# Altium project SG_CAN_Board_2019.PrjPCB
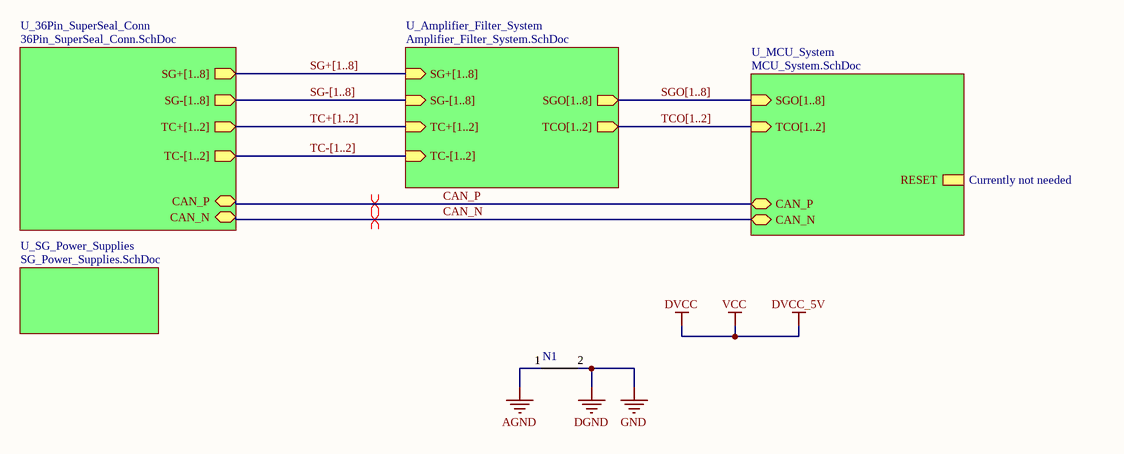
[diagram p0: SG_CAN_System.SchDoc]
7 sheets, 109 parts. Net scope: hierarchical (ports join the sheet entries above them; power ports are global).
Board file: SG_CAN_Board.PcbDoc
Sheets:
  SG_CAN_System.SchDoc
    U_MCU_System = MCU_System.SchDoc
    U_Amplifier_Filter_System = Amplifier_Filter_System.SchDoc
      SG1 = SG_Amplifiers_LTC2053.SchDoc
      SG2 = SG_Amplifiers_LTC2053.SchDoc
      SG3 = SG_Amplifiers_LTC2053.SchDoc
      SG4 = SG_Amplifiers_LTC2053.SchDoc
      SG5 = SG_Amplifiers_LTC2053.SchDoc
      SG6 = SG_Amplifiers_LTC2053.SchDoc
      SG7 = SG_Amplifiers_LTC2053.SchDoc
      SG8 = SG_Amplifiers_LTC2053.SchDoc
      Th1 = ThermocoupleAmplifiersAD8494.SchDoc
      Th2 = ThermocoupleAmplifiersAD8494.SchDoc
    U_36Pin_SuperSeal_Conn = 36Pin_SuperSeal_Conn.SchDoc
    U_SG_Power_Supplies = SG_Power_Supplies.SchDoc

## Sheet SG_CAN_System.SchDoc
size A

### Parts
N1  (no value)  [Net_Tie]

### Sub-sheets
U_36Pin_SuperSeal_Conn = 36Pin_SuperSeal_Conn.SchDoc: SG+[1..8] (out), SG-[1..8] (out), CAN_P (bidir), CAN_N (bidir), TC+[1..2] (out), TC-[1..2] (out)
U_Amplifier_Filter_System = Amplifier_Filter_System.SchDoc: SG+[1..8] (in), SG-[1..8] (in), SGO[1..8] (out), TC+[1..2] (in), TC-[1..2] (in), TCO[1..2] (out)
U_MCU_System = MCU_System.SchDoc: SGO[1..8] (in), TCO[1..2] (in), CAN_P (bidir), CAN_N (bidir), RESET
U_SG_Power_Supplies = SG_Power_Supplies.SchDoc: no entries

### Nets
AGND: N1.1
DGND: N1.2  [also labelled GND]
CAN_N: sheet U_MCU_System/CAN_N, sheet U_36Pin_SuperSeal_Conn/CAN_N
CAN_P: sheet U_MCU_System/CAN_P, sheet U_36Pin_SuperSeal_Conn/CAN_P

### Buses and harness runs
bus SG+[1..8] = sheet U_36Pin_SuperSeal_Conn/SG+[1..8] = sheet U_Amplifier_Filter_System/SG+[1..8]
bus SG-[1..8] = sheet U_36Pin_SuperSeal_Conn/SG-[1..8] = sheet U_Amplifier_Filter_System/SG-[1..8]
bus SGO[1..8] = sheet U_Amplifier_Filter_System/SGO[1..8] = sheet U_MCU_System/SGO[1..8]
bus TC+[1..2] = sheet U_36Pin_SuperSeal_Conn/TC+[1..2] = sheet U_Amplifier_Filter_System/TC+[1..2]
bus TC-[1..2] = sheet U_36Pin_SuperSeal_Conn/TC-[1..2] = sheet U_Amplifier_Filter_System/TC-[1..2]
bus TCO[1..2] = sheet U_Amplifier_Filter_System/TCO[1..2] = sheet U_MCU_System/TCO[1..2]

### Layout directives
differential pair: CAN_N, CAN_P

### Notes on the sheet
- Currently not needed

### Library data of the parts
N1 = 1: Manufacturer_id: 1; idFuse: 3; Name: Net Tie; Drawer_id: 1; idShunt: 1

## Sheet MCU_System.SchDoc
size A
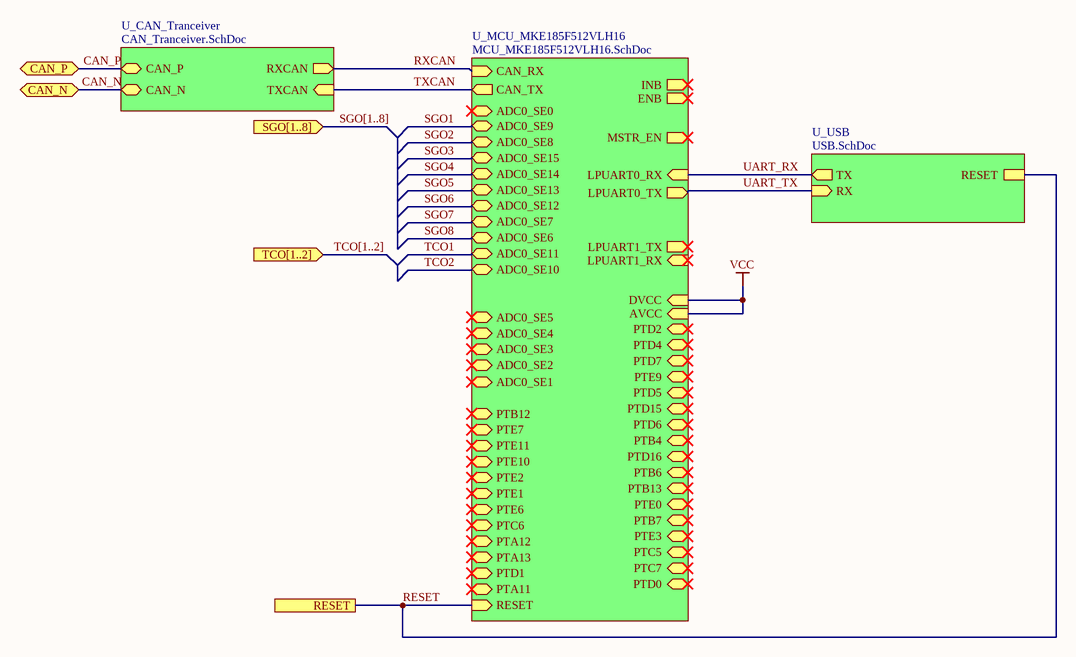
[diagram p1: MCU_System.SchDoc]

### Sub-sheets
U_CAN_Tranceiver = CAN_Tranceiver.SchDoc (file not in this document): TXCAN (in), RXCAN (out), CAN_P (bidir), CAN_N (bidir)
U_MCU_MKE185F512VLH16 = MCU_MKE185F512VLH16.SchDoc (file not in this document): CAN_TX (out), CAN_RX (in), INB (out), ENB (out), ADC0_SE11 (bidir), ADC0_SE10 (bidir), ADC0_SE9 (bidir), ADC0_SE8 (bidir), ADC0_SE15 (bidir), ADC0_SE14 (bidir), ADC0_SE13 (bidir), ADC0_SE12 (bidir), ADC0_SE7 (bidir), ADC0_SE6 (bidir), ADC0_SE1 (bidir), ADC0_SE0 (bidir), LPUART0_TX (out), LPUART0_RX (in), MSTR_EN (out), ADC0_SE5 (bidir), ADC0_SE4 (bidir), LPUART1_TX (out), LPUART1_RX (in), ADC0_SE3 (bidir), ADC0_SE2 (bidir), DVCC (in), AVCC (in), RESET (in), PTD2 (bidir), PTD4 (bidir), PTD7 (bidir), PTE9 (bidir), PTD5 (bidir), PTD15 (bidir), PTD6 (bidir), PTB4 (bidir), PTD16 (bidir), PTB6 (bidir), PTB13 (bidir), PTE0 (bidir), PTB7 (bidir), PTE3 (bidir), PTC5 (bidir), PTC7 (bidir), PTD0 (bidir), PTB12 (bidir), PTE7 (bidir), PTE11 (bidir), PTE10 (bidir), PTE2 (bidir), PTE1 (bidir), PTE6 (bidir), PTC6 (bidir), PTA12 (bidir), PTA13 (bidir), PTD1 (bidir), PTA11 (bidir)
U_USB = USB.SchDoc (file not in this document): TX (out), RX (in), RESET

### Ports
CAN_N (bidir), CAN_P (bidir), RESET, SGO[1..8] (in), TCO[1..2] (in)

### Nets
VCC: sheet U_MCU_MKE185F512VLH16/DVCC, sheet U_MCU_MKE185F512VLH16/AVCC  [project net DVCC]
CAN_N: port CAN_N, sheet U_CAN_Tranceiver/CAN_N
CAN_P: port CAN_P, sheet U_CAN_Tranceiver/CAN_P
RESET: port RESET, sheet U_USB/RESET, sheet U_MCU_MKE185F512VLH16/RESET
RXCAN: sheet U_CAN_Tranceiver/RXCAN, sheet U_MCU_MKE185F512VLH16/CAN_RX
TXCAN: sheet U_CAN_Tranceiver/TXCAN, sheet U_MCU_MKE185F512VLH16/CAN_TX
UART_RX: sheet U_USB/TX, sheet U_MCU_MKE185F512VLH16/LPUART0_RX
UART_TX: sheet U_USB/RX, sheet U_MCU_MKE185F512VLH16/LPUART0_TX

### Buses and harness runs
bus SGO[1..8] = port SGO[1..8]
bus TCO[1..2] = port TCO[1..2]

## Sheet Amplifier_Filter_System.SchDoc
size A
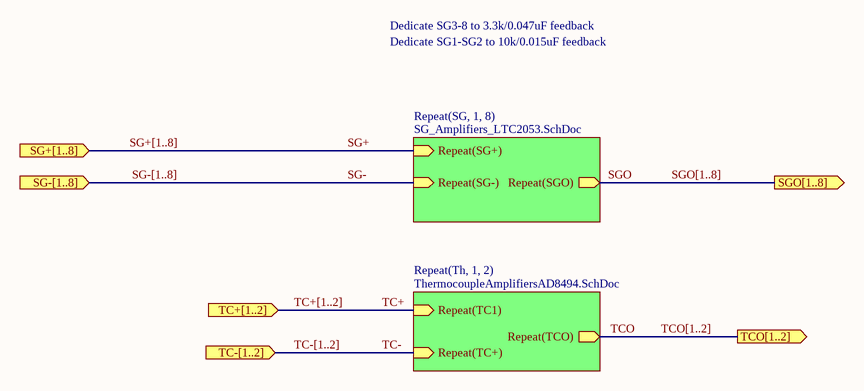
[diagram p2: Amplifier_Filter_System.SchDoc]

### Sub-sheets
Repeat(SG, 1, 8) = SG_Amplifiers_LTC2053.SchDoc: Repeat(SG+) (in), Repeat(SG-) (in), Repeat(SGO) (out)
Repeat(Th, 1, 2) = ThermocoupleAmplifiersAD8494.SchDoc: Repeat(TC1) (in), Repeat(TC+) (in), Repeat(TCO) (out)

### Ports
SG+[1..8] (in), SG-[1..8] (in), SGO[1..8] (out), TC+[1..2] (in), TC-[1..2] (in), TCO[1..2] (out)

### Nets
SG+: sheet Repeat(SG, 1, 8)/Repeat(SG+)
SG-: sheet Repeat(SG, 1, 8)/Repeat(SG-)
SGO: sheet Repeat(SG, 1, 8)/Repeat(SGO)
TC+: sheet Repeat(Th, 1, 2)/Repeat(TC1)
TC-: sheet Repeat(Th, 1, 2)/Repeat(TC+)
TCO: sheet Repeat(Th, 1, 2)/Repeat(TCO)

### Buses and harness runs
bus SG+[1..8] = port SG+[1..8]
bus SG-[1..8] = port SG-[1..8]
bus SGO[1..8] = port SGO[1..8]
bus TC+[1..2] = port TC+[1..2]
bus TC-[1..2] = port TC-[1..2]
bus TCO[1..2] = port TCO[1..2]

### Notes on the sheet
- Dedicate SG3-8 to 3.3k/0.047uF feedback
- Dedicate SG1-SG2 to 10k/0.015uF feedback

## Sheet SG_Amplifiers_LTC2053.SchDoc
size A
Used 8 times, as channels U_Amplifier_Filter_System/SG1, U_Amplifier_Filter_System/SG2, U_Amplifier_Filter_System/SG3, U_Amplifier_Filter_System/SG4, U_Amplifier_Filter_System/SG5, U_Amplifier_Filter_System/SG6, U_Amplifier_Filter_System/SG7, U_Amplifier_Filter_System/SG8. Parts and nets are listed once, with the designators drawn on the sheet.
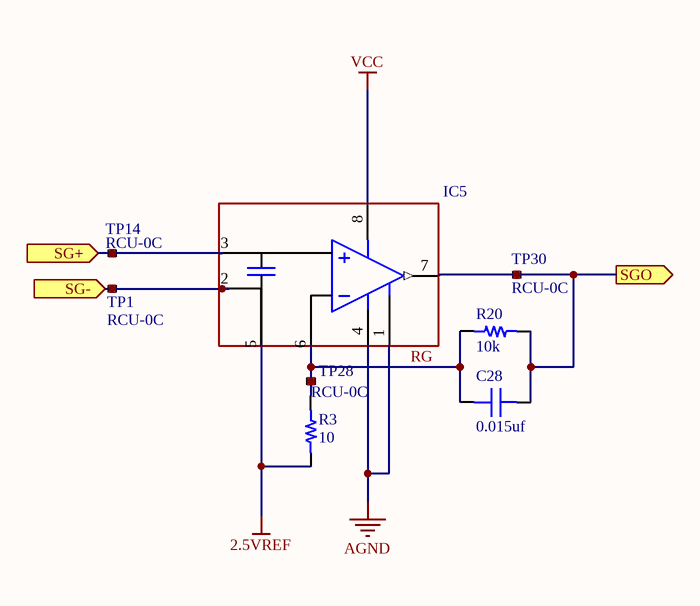
[diagram p3: SG_Amplifiers_LTC2053.SchDoc]

### Parts
C28  value 0.015uf  [CAP 0603/1608]  (hidden comment: Capacitor MLCC 0.015uf 25V CAP 0603/1608)
IC5  (no value)  [MSOP-8]
R3  value 10  [RES 0603/1608]  (hidden comment: Resistor 10 0603 1/10W 1%)
R20  value 10k  [RES 0603/1608]  (hidden comment: Resistor 10k 0603 1/10W 1%)
TP1  RCU-0C  [RCU-0C]
TP14  RCU-0C  [RCU-0C]
TP28  RCU-0C  [RCU-0C]
TP30  RCU-0C  [RCU-0C]

### Ports
SG+ (in), SG- (in), SGO (out)

### Nets
2.5VREF: IC5.5(REF) R3.1
AGND: IC5.1 IC5.4(V-)
VCC: IC5.8(V+)
RG: C28.1 IC5.6(RG) R3.2 R20.1 TP28.1
SG+: IC5.3(+IN) TP14.1 ; port SG+
SG-: IC5.2(-IN) TP1.1 ; port SG-
SGO: C28.2 IC5.7(OUT) R20.2 TP30.1 ; port SGO

### Channels
U_Amplifier_Filter_System/SG1: designators C28=C30 IC5=IC7 R3=R31 R20=R24 TP1=TP10 TP14=TP22 TP28=TP34 TP30=TP41; ports SG+=SG+1 SG-=SG-1 SGO=SGO1
U_Amplifier_Filter_System/SG2: designators C28=C23 IC5=IC8 R3=R17 R20=R16 TP1=TP11 TP14=TP23 TP28=TP42 TP30=TP43; ports SG+=SG+2 SG-=SG-2 SGO=SGO2
U_Amplifier_Filter_System/SG3: designators C28=C29 IC5=IC6 R3=R30 R20=R23 TP1=TP9 TP14=TP21 TP28=TP33 TP30=TP40; ports SG+=SG+3 SG-=SG-3 SGO=SGO3
U_Amplifier_Filter_System/SG4: designators C28=C28 IC5=IC5 R3=R29 R20=R22 TP1=TP8 TP14=TP20 TP28=TP32 TP30=TP39; ports SG+=SG+4 SG-=SG-4 SGO=SGO4
U_Amplifier_Filter_System/SG5: designators C28=C27 IC5=IC4 R3=R28 R20=R21 TP1=TP7 TP14=TP19 TP28=TP31 TP30=TP38; ports SG+=SG+5 SG-=SG-5 SGO=SGO5
U_Amplifier_Filter_System/SG6: designators C28=C26 IC5=IC3 R3=R27 R20=R20 TP1=TP6 TP14=TP18 TP28=TP30 TP30=TP37; ports SG+=SG+6 SG-=SG-6 SGO=SGO6
U_Amplifier_Filter_System/SG7: designators C28=C25 IC5=IC2 R3=R26 R20=R19 TP1=TP5 TP14=TP17 TP28=TP29 TP30=TP36; ports SG+=SG+7 SG-=SG-7 SGO=SGO7
U_Amplifier_Filter_System/SG8: designators C28=C24 IC5=IC1 R3=R25 R20=R18 TP1=TP4 TP14=TP16 TP28=TP28 TP30=TP35; ports SG+=SG+8 SG-=SG-8 SGO=SGO8

### Library data of the parts
C28 = 578: Manufacturer_id: 1; idCapacitor: 578; Name: Cap_0.015uf_25V_CAP 0603/1608; Dielectric: Ceramic; Created_By: Nick Mah; Drawer_id: 1; Voltage_Rating: 25V; Package: CAP 0603/1608; Created_Date: 10/20/2018
IC5 = 2: Manufacturer_id: 1; MfrPartNo: LTC2053; idOp_Amp: 2; Name: Instrumentation Amplifier; Amplifier_Type: Instrumentation; Supply_Voltage: 2.7V to ±5.5V; Created_By: Angel Delgado; Drawer_id: 1; Num_Circuits: 1; Package: MSOP8; Link: https://www.digikey.com/product-detail/en/linear-technology-analog-devices/LTC2053CMS8-TRPBF/LTC2053CMS8-TRPBFCT-ND/5892339
R3 = 241: Manufacturer_id: 1; idResistor: 241; Name: Res_10_0603_1/10W_1%; Created_By: Nick Mah; Supplier 1: Digi-Key; Drawer_id: 1; Tolerance: 1%; Power: 1/10W; Package: 0603; ComponentLink1Description: Datasheet; Created_Date: 2018-10-20
R20 = 313: Manufacturer_id: 1; idResistor: 313; Name: Res_10k_0603_1/10W_1%; Created_By: Nick Mah; Supplier 1: Digi-Key; Drawer_id: 1; Tolerance: 1%; Power: 1/10W; Package: 0603; ComponentLink1Description: Datasheet; Created_Date: 2018-10-20
TP1 TP14 TP28 TP30 = 14: Test point; Manufacturer_id: 1; idConn: 14; Value: CONN; Created_By: Graydon; Updated_By: Null; Drawer_id: 1; Name: RCU-0C; Num_Contacts: 1; Num_Rows: 1; Package: RCU-0C; MfrPartNo: RCU-0C; Link: https://www.digikey.com/product-detail/en/te-connectivity-amp-connectors/RCU-0C/A106145CT-ND/3477802; ComponentLink1Description: Null; ComponentLink1URL: Null; Supplier1: None; Supplier1PartNo: None; Created_Date: 11/10/2018

## Sheet ThermocoupleAmplifiersAD8494.SchDoc
size A
Used 2 times, as channels U_Amplifier_Filter_System/Th1, U_Amplifier_Filter_System/Th2. Parts and nets are listed once, with the designators drawn on the sheet.
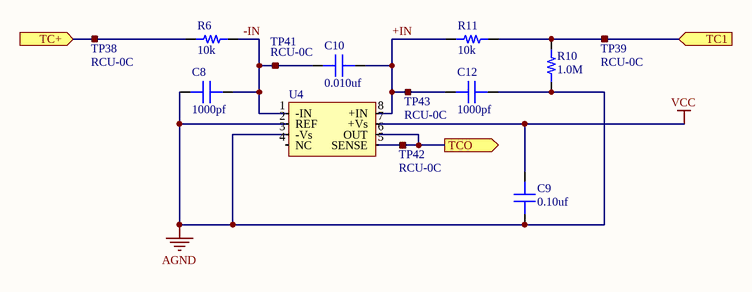
[diagram p4: ThermocoupleAmplifiersAD8494.SchDoc]

### Parts
C8  value 1000pf  [CAP 0603/1608]  (hidden comment: Capacitor MLCC 1000pf 16V CAP 0603/1608)
C9  value 0.10uf  [CAP 0603/1608]  (hidden comment: Capacitor MLCC 0.10uf 16V CAP 0603/1608)
C10  value 0.010uf  [CAP 0603/1608]  (hidden comment: Capacitor MLCC 0.010uf 16V CAP 0603/1608)
C12  value 1000pf  [CAP 0603/1608]  (hidden comment: Capacitor MLCC 1000pf 16V CAP 0603/1608)
R6  value 10k  [RES 0603/1608]  (hidden comment: Resistor 10k 0603 1/10W 10%)
R10  value 1.0M  [RES 0603/1608]  (hidden comment: Resistor 1.0M 0603 1/10W 5%)
R11  value 10k  [RES 0603/1608]  (hidden comment: Resistor 10k 0603 1/10W 10%)
TP38  RCU-0C  [RCU-0C]
TP39  RCU-0C  [RCU-0C]
TP41  RCU-0C  [RCU-0C]
TP42  RCU-0C  [RCU-0C]
TP43  RCU-0C  [RCU-0C]
U4  (no value)  [MSOP-8]

### Ports
TC1 (in), TC+ (in), TCO (out)

### Nets
AGND: C8.1 C9.1 C12.2 R10.1 U4.2(REF) U4.3(-Vs)
VCC: C9.2 U4.7(+Vs)
+IN: C10.2 C12.1 R11.1 TP43.1 U4.8(+IN)
-IN: C8.2 C10.1 R6.2 TP41.1 U4.1(-IN)
TC1: R10.2 R11.2 TP39.1 ; port TC1
TC+: R6.1 TP38.1 ; port TC+
TCO: TP42.1 U4.5(SENSE) U4.6(OUT) ; port TCO

Not connected (* = marked no-connect by the designer): U4 4(NC)

### Channels
U_Amplifier_Filter_System/Th1: designators C8=C2 C9=C21 C10=C4 C12=C6 R6=R2 R10=R4 R11=R6 TP38=TP3 TP39=TP13 TP41=TP15 TP42=TP26 TP43=TP27 U4=U2; ports TC1=TC+1 TC+=TC-1 TCO=TCO1
U_Amplifier_Filter_System/Th2: designators C8=C1 C9=C22 C10=C3 C12=C5 R6=R1 R10=R3 R11=R5 TP38=TP2 TP39=TP12 TP41=TP14 TP42=TP24 TP43=TP25 U4=U1; ports TC1=TC+2 TC+=TC-2 TCO=TCO2

### Library data of the parts
C8 C12 = 193: Manufacturer_id: 1; idCapacitor: 193; Name: Cap_1000pf_16V_CAP 0603/1608; Dielectric: Ceramic; Created_By: Nick Mah; Drawer_id: 1; Voltage_Rating: 16V; Package: CAP 0603/1608; Created_Date: 10/20/2018
C9 = 223: Manufacturer_id: 1; idCapacitor: 223; Name: Cap_0.10uf_16V_CAP 0603/1608; Dielectric: Ceramic; Created_By: Nick Mah; Drawer_id: 1; Voltage_Rating: 16V; Package: CAP 0603/1608; Created_Date: 10/20/2018
C10 = 217: Manufacturer_id: 1; idCapacitor: 217; Name: Cap_0.010uf_16V_CAP 0603/1608; Dielectric: Ceramic; Created_By: Nick Mah; Drawer_id: 1; Voltage_Rating: 16V; Package: CAP 0603/1608; Created_Date: 10/20/2018
R6 R11 = 2317: Manufacturer_id: 1; idResistor: 2317; Name: Res_10k_0603_1/10W_10%; Created_By: Nick Mah; Supplier 1: Digi-Key; Drawer_id: 1; Tolerance: 10%; Power: 1/10W; Package: 0603; ComponentLink1Description: Datasheet; Created_Date: 2018-10-20
R10 = 1441: Manufacturer_id: 1; idResistor: 1441; Name: Res_1.0M_0603_1/10W_5%; Created_By: Nick Mah; Supplier 1: Digi-Key; Drawer_id: 1; Tolerance: 5%; Power: 1/10W; Package: 0603; ComponentLink1Description: Datasheet; Created_Date: 2018-10-20
TP38 TP39 TP41-TP43 = 14: as TP1 on sheet SG_Amplifiers_LTC2053; Drawer_id: 1; Name: RCU-0C; Num_Contacts: 1; Num_Rows: 1; Package: RCU-0C; MfrPartNo: RCU-0C; Link: https://www.digikey.com/product-detail/en/te-connectivity-amp-connectors/RCU-0C/A106145CT-ND/3477802; ComponentLink1Description: Null; ComponentLink1URL: Null; Supplier1: None; Supplier1PartNo: None; Created_Date: 11/10/2018
U4 = 3: IC THRMOCPLE COLD JNC COMP 8MSOP; Manufacturer_id: 1; MfrPartNo: AD8494CRMZ; idOp_Amp: 3; Name: AD8494 Thermocouple Amplifier; Value: K-type; Amplifier_Type: Thermocouple Amplifier; Supply_Voltage: +-18,2.7-36; Created_By: Nick Mah; Drawer_id: 1; Num_Circuits: 1; Package: MSOP8; Link: https://www.digikey.com/product-detail/en/analog-devices-inc/AD8494CRMZ/AD8494CRMZ-ND/2606669; ComponentLink1Description: Datasheet; ComponentLink1URL: http://www.digchip.com/data/041/041-93390-AD8494.pdf; Supplier1: Digi-Key; Supplier1PartNo: AD8494CRMZ-ND

## Sheet 36Pin_SuperSeal_Conn.SchDoc
size A
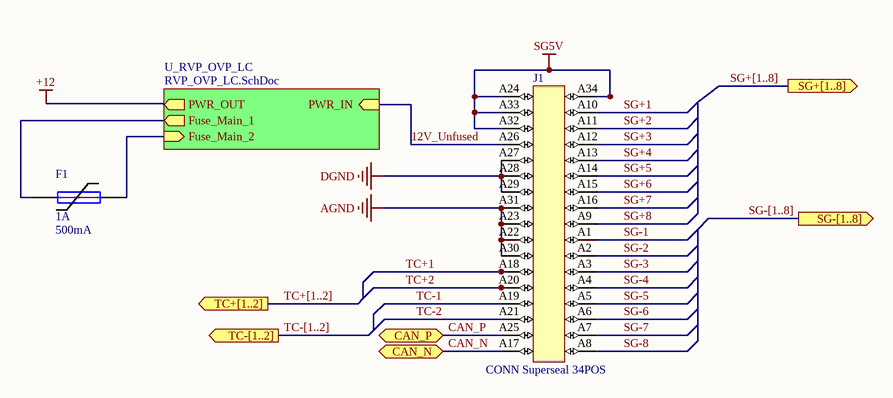
[diagram p5: 36Pin_SuperSeal_Conn.SchDoc]

### Parts
F1  1A  I_hold: 500mA  [PTC Fuse 1206/3216]
J1  CONN Superseal 34POS  [Superseal 34POS]

### Sub-sheets
U_RVP_OVP_LC = RVP_OVP_LC.SchDoc (file not in this document): PWR_IN (in), PWR_OUT (out), Fuse_Main_2 (in), Fuse_Main_1 (out)

### Ports
CAN_N (bidir), CAN_P (bidir), SG+[1..8] (out), SG-[1..8] (out), TC+[1..2] (out), TC-[1..2] (out)

### Nets
AGND: J1.A22 J1.A23 J1.A30 J1.A31
DGND: J1.A27 J1.A28 J1.A29
SG5V: J1.A24 J1.A32 J1.A33 J1.A34
12V_Unfused: J1.A26 ; sheet U_RVP_OVP_LC/PWR_IN
CAN_N: J1.A17 ; port CAN_N
CAN_P: J1.A25 ; port CAN_P
SG+1: J1.A10
SG+2: J1.A11
SG+3: J1.A12
SG+4: J1.A13
SG+5: J1.A14
SG+6: J1.A15
SG+7: J1.A16
SG+8: J1.A9
SG-1: J1.A1
SG-2: J1.A2
SG-3: J1.A3
SG-4: J1.A4
SG-5: J1.A5
SG-6: J1.A6
SG-7: J1.A7
SG-8: J1.A8
TC+1: J1.A18
TC+2: J1.A20
TC-1: J1.A19
TC-2: J1.A21
NetF1_1: F1.1 ; sheet U_RVP_OVP_LC/Fuse_Main_1
NetF1_2: F1.2 ; sheet U_RVP_OVP_LC/Fuse_Main_2

### Buses and harness runs
bus SG+[1..8] = port SG+[1..8]
bus SG-[1..8] = port SG-[1..8]
bus TC+[1..2] = port TC+[1..2]
bus TC-[1..2] = port TC-[1..2]

### Library data of the parts
F1 = 5: Fuse; Manufacturer_id: 1; MfrPartNo: 1206L050/15YR; idFuse: 5; Name: PTC Poly Fuse Resettable; I_max: 100A; V_max: 15V; Pd_Typ: 600mW; Created_By: Angel; Published: 8-Jun-2000; LatestRevisionDate: 17-Jul-2002; LatestRevisionNote: Re-released for DXP Platform.; PackageReference: PIN-W2/E2.8; Publisher: Altium Limited; PackageDescription: Thru-Hole; 2 Leads; Drawer_id: 1; I_trip: 1A; Link: https://www.digikey.com/product-detail/en/littelfuse-inc/1206L050-15YR/F3733CT-ND/2486168; Created_Date: 10/27/2018
J1 = 11: Connector Header Through Hole, Right Angle 34 position 0.118" (3.00mm); Manufacturer_id: 5; MfrPartNo: 6437288-1; idConn: 11; Drawer_id: 1; Name: AMP Superseal 34 POS; Voltage_Rating: 250VDC; Num_Contacts: 34; Num_Rows: 4; Pitch: 3mm; Value: CONN; Link: https://www.digikey.com/products/en?mpart=6437288-1&&csp=WT.z_cid%3Dsp_8004_20120425_buynow%26TE_cid%3D8004-1541898693362; ComponentLink1Description: Datasheet; ComponentLink1URL: https://www.te.com/commerce/DocumentDelivery/DDEController?Action=srchrtrv&DocNm=6437288-1&DocType=Customer+Drawing&DocLang=Japanese; Supplier1: Digi-Key; Supplier1PartNo: A124384-ND

## Sheet SG_Power_Supplies.SchDoc
size A
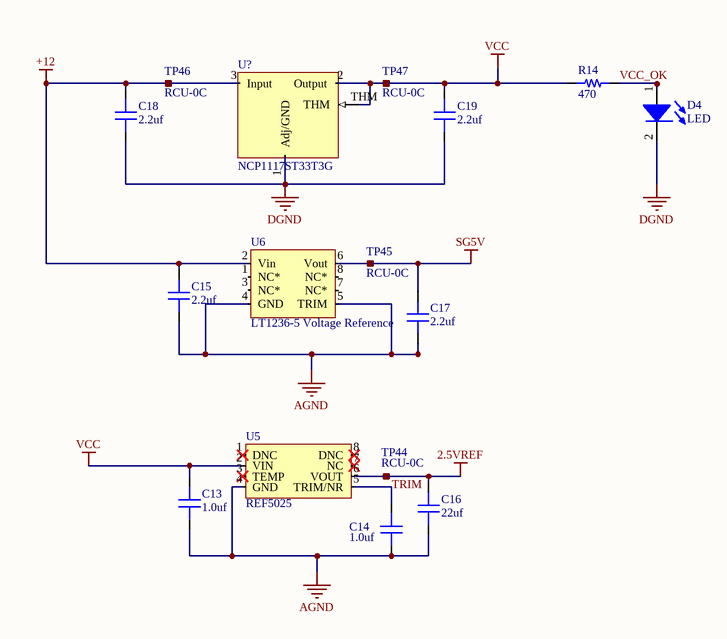
[diagram p6: SG_Power_Supplies.SchDoc]

### Parts
C13  value 1.0uf  [CAP 0603/1608]  (hidden comment: Capacitor MLCC 1.0uf 25V CAP 0603/1608)
C14  value 1.0uf  [CAP 0603/1608]  (hidden comment: Capacitor MLCC 1.0uf 25V CAP 0603/1608)
C15  value 2.2uf  [CAP 0603/1608]  (hidden comment: Capacitor MLCC 2.2uf 25V CAP 0603/1608)
C16  value 22uf  [CAP 0603/1608]  (hidden comment: Capacitor MLCC 22uf 16V CAP 0603/1608)
C17  value 2.2uf  [CAP 0603/1608]  (hidden comment: Capacitor MLCC 2.2uf 25V CAP 0603/1608)
C18  value 2.2uf  [CAP 0805/2012]  (hidden comment: Capacitor MLCC 2.2uf 25V CAP 0805/2012)
C19  value 2.2uf  [CAP 0805/2012]  (hidden comment: Capacitor MLCC 2.2uf 25V CAP 0805/2012)
D4  LED  [0805_LED]
R14  value 470  [RES 0805/2012]  (hidden comment: Resistor 470 0805 1/10W 1%)
TP44  RCU-0C  [RCU-0C]
TP45  RCU-0C  [RCU-0C]
TP46  RCU-0C  [RCU-0C]
TP47  RCU-0C  [RCU-0C]
U5  REF5025  [SOIC-8]
U6  LT1236-5 Voltage Reference  [SOIC-8]
U?1  NCP1117ST33T3G  [SOT-223-3]

### Nets
2.5VREF: C16.2 TP44.1 U5.6(VOUT)
+12: C15.2 C18.2 TP46.1 U6.2(Vin) U?1.3(Input)
AGND: C13.1 C14.1 C15.1 C16.1 C17.1 U5.4(GND) U6.4(GND) U6.5(TRIM)
DGND: C18.1 C19.1 D4.2(K) U?1.1(Adj/GND)
SG5V: C17.2 TP45.1 U6.6(Vout)
VCC: C13.2 C19.2 R14.1 TP47.1 U5.2(VIN) U?1.2(Output) U?1.THM  [project net DVCC]
TRIM: C14.2 U5.5(TRIM/NR)
VCC_OK: D4.1(A) R14.2

Not connected (* = marked no-connect by the designer): U5 1(DNC)* 3(TEMP)* 7(NC)* 8(DNC)*; U6 1(NC*) 3(NC*) 7(NC*) 8(NC*)

### Library data of the parts
C13 C14 = 589: Manufacturer_id: 1; idCapacitor: 589; Name: Cap_1.0uf_25V_CAP 0603/1608; Dielectric: Ceramic; Created_By: Nick Mah; Drawer_id: 1; Voltage_Rating: 25V; Package: CAP 0603/1608; Created_Date: 10/20/2018
C15 C17 = 591: Manufacturer_id: 1; idCapacitor: 591; Name: Cap_2.2uf_25V_CAP 0603/1608; Dielectric: Ceramic; Created_By: Nick Mah; Drawer_id: 1; Voltage_Rating: 25V; Package: CAP 0603/1608; Created_Date: 10/20/2018
C16 = 237: Manufacturer_id: 1; idCapacitor: 237; Name: Cap_22uf_16V_CAP 0603/1608; Dielectric: Ceramic; Created_By: Nick Mah; Drawer_id: 1; Voltage_Rating: 16V; Package: CAP 0603/1608; Created_Date: 10/20/2018
C18 C19 = 711: Manufacturer_id: 1; idCapacitor: 711; Name: Cap_2.2uf_25V_CAP 0805/2012; Dielectric: Ceramic; Created_By: Nick Mah; Drawer_id: 1; Voltage_Rating: 25V; Package: CAP 0805/2012; Created_Date: 10/20/2018
D4 = 2: Manufacturer_id: 1; idLED: 2; Name: CMD17_0805_GREEN; Value: Green; Brightness: 7mcd; Id: 20mA; Vf: 2.1V; Drawer_id: 1; Package: 0805; Link: https://www.digikey.com/product-detail/en/visual-communications-company-vcc/CMD17-21VGD-TR8/L62505CT-ND/254936
R14 = 497: Manufacturer_id: 1; idResistor: 497; Name: Res_470_0805_1/10W_1%; Created_By: Nick Mah; Supplier 1: Digi-Key; Drawer_id: 1; Tolerance: 1%; Power: 1/10W; Package: 0805; ComponentLink1Description: Datasheet; Created_Date: 2018-10-20
TP44-TP47 = 14: as TP1 on sheet SG_Amplifiers_LTC2053; Drawer_id: 1; Name: RCU-0C; Num_Contacts: 1; Num_Rows: 1; Package: RCU-0C; MfrPartNo: RCU-0C; Link: https://www.digikey.com/product-detail/en/te-connectivity-amp-connectors/RCU-0C/A106145CT-ND/3477802; ComponentLink1Description: Null; ComponentLink1URL: Null; Supplier1: None; Supplier1PartNo: None; Created_Date: 11/10/2018
U5 = 9: Series Voltage Reference IC ±0.1% 10mA 8-SOIC; Manufacturer_id: 1; MfrPartNo: REF5025AIDR; idPMIC_Lin: 9; Name: REF5025_2.5V_Reg; Value: 2.5V Reference; Vin(Min): 2.7V; Vin(Max): 18V; Vout(Min): 2.5V; Vout_Type: Fixed; Dropout_Voltage: 200mV; Drawer_id: 1; Num_Outputs: 1; Power: Reference; Vout(Max): 2.5V; Current_Rating: 10mA; Package: SOIC-8; Link: https://www.digikey.com/product-detail/en/texas-instruments/REF5025AIDR/296-39165-2-ND/1900163; ComponentLink1Description: Datasheet; ComponentLink1URL: http://www.ti.com/lit/ds/symlink/ref5020.pdf; Supplier1: Digi-Key; Supplier1PartNo: 296-39165-2-ND
U6 = 2: Manufacturer_id: 1; idIC_Misc: 2; Name: Voltage Ref LT1236-5; Drawer_id: 1
U?1 = 15: 1.0 A Low Dropout Positive and Adjustable Voltage Regulator; Manufacturer_id: 1; idPMIC_Lin: 15; Name: 3.3V 1.0A LDO; Value: 3.3V 1.0A; Vin(Max): 20V; Vout(Max): 3.3V; Current_Rating: 1A; Dropout_Voltage: 1.2V @ 800mA; Drawer_id: 1; Num_Outputs: 1; Package: SOT-223-3; MfrPartNo: NCP1117ST33T3G; Link: https://www.digikey.com/product-detail/en/on-semiconductor/NCP1117ST33T3G/NCP1117ST33T3GOSCT-ND/660708?utm_adgroup=Integrated%20Circuits&slid=&gclid=CjwKCAjwpKveBRAwEiwAo4Pqm-q33kFM8zFNc6HZ2F-pR13_ETd6YlqjCAqcJjAXoyQWdArbQQWp4hoCk3EQAvD_BwE

## Nets that join several sheets
2.5VREF: U_Amplifier_Filter_System/SG1 (IC7.5 R31.1), U_Amplifier_Filter_System/SG2 (IC8.5 R17.1), U_Amplifier_Filter_System/SG3 (IC6.5 R30.1), U_Amplifier_Filter_System/SG4 (IC5.5 R29.1), U_Amplifier_Filter_System/SG5 (IC4.5 R28.1), U_Amplifier_Filter_System/SG6 (IC3.5 R27.1), U_Amplifier_Filter_System/SG7 (IC2.5 R26.1), U_Amplifier_Filter_System/SG8 (IC1.5 R25.1), SG_Power_Supplies (C16.2 TP44.1 U5.6)
AGND: SG_CAN_System (N1.1), U_Amplifier_Filter_System/SG1 (IC7.1 IC7.4), U_Amplifier_Filter_System/SG2 (IC8.1 IC8.4), U_Amplifier_Filter_System/SG3 (IC6.1 IC6.4), U_Amplifier_Filter_System/SG4 (IC5.1 IC5.4), U_Amplifier_Filter_System/SG5 (IC4.1 IC4.4), U_Amplifier_Filter_System/SG6 (IC3.1 IC3.4), U_Amplifier_Filter_System/SG7 (IC2.1 IC2.4), U_Amplifier_Filter_System/SG8 (IC1.1 IC1.4), U_Amplifier_Filter_System/Th1 (6 pins), U_Amplifier_Filter_System/Th2 (6 pins), 36Pin_SuperSeal_Conn (J1.A22 J1.A23 J1.A30 J1.A31), SG_Power_Supplies (8 pins)
DGND: SG_CAN_System (N1.2), 36Pin_SuperSeal_Conn (J1.A27 J1.A28 J1.A29), SG_Power_Supplies (C18.1 C19.1 D4.2 U?1.1)
DVCC: U_Amplifier_Filter_System/SG1 (IC7.8), U_Amplifier_Filter_System/SG2 (IC8.8), U_Amplifier_Filter_System/SG3 (IC6.8), U_Amplifier_Filter_System/SG4 (IC5.8), U_Amplifier_Filter_System/SG5 (IC4.8), U_Amplifier_Filter_System/SG6 (IC3.8), U_Amplifier_Filter_System/SG7 (IC2.8), U_Amplifier_Filter_System/SG8 (IC1.8), U_Amplifier_Filter_System/Th1 (C21.2 U2.7), U_Amplifier_Filter_System/Th2 (C22.2 U1.7), SG_Power_Supplies (7 pins)
SG5V: 36Pin_SuperSeal_Conn (J1.A24 J1.A32 J1.A33 J1.A34), SG_Power_Supplies (C17.2 TP45.1 U6.6)
SG+1: U_Amplifier_Filter_System/SG1 (IC7.3 TP22.1), 36Pin_SuperSeal_Conn (J1.A10)
SG+2: U_Amplifier_Filter_System/SG2 (IC8.3 TP23.1), 36Pin_SuperSeal_Conn (J1.A11)
SG+3: U_Amplifier_Filter_System/SG3 (IC6.3 TP21.1), 36Pin_SuperSeal_Conn (J1.A12)
SG+4: U_Amplifier_Filter_System/SG4 (IC5.3 TP20.1), 36Pin_SuperSeal_Conn (J1.A13)
SG+5: U_Amplifier_Filter_System/SG5 (IC4.3 TP19.1), 36Pin_SuperSeal_Conn (J1.A14)
SG+6: U_Amplifier_Filter_System/SG6 (IC3.3 TP18.1), 36Pin_SuperSeal_Conn (J1.A15)
SG+7: U_Amplifier_Filter_System/SG7 (IC2.3 TP17.1), 36Pin_SuperSeal_Conn (J1.A16)
SG+8: U_Amplifier_Filter_System/SG8 (IC1.3 TP16.1), 36Pin_SuperSeal_Conn (J1.A9)
SG-1: U_Amplifier_Filter_System/SG1 (IC7.2 TP10.1), 36Pin_SuperSeal_Conn (J1.A1)
SG-2: U_Amplifier_Filter_System/SG2 (IC8.2 TP11.1), 36Pin_SuperSeal_Conn (J1.A2)
SG-3: U_Amplifier_Filter_System/SG3 (IC6.2 TP9.1), 36Pin_SuperSeal_Conn (J1.A3)
SG-4: U_Amplifier_Filter_System/SG4 (IC5.2 TP8.1), 36Pin_SuperSeal_Conn (J1.A4)
SG-5: U_Amplifier_Filter_System/SG5 (IC4.2 TP7.1), 36Pin_SuperSeal_Conn (J1.A5)
SG-6: U_Amplifier_Filter_System/SG6 (IC3.2 TP6.1), 36Pin_SuperSeal_Conn (J1.A6)
SG-7: U_Amplifier_Filter_System/SG7 (IC2.2 TP5.1), 36Pin_SuperSeal_Conn (J1.A7)
SG-8: U_Amplifier_Filter_System/SG8 (IC1.2 TP4.1), 36Pin_SuperSeal_Conn (J1.A8)
TC+1: U_Amplifier_Filter_System/Th1 (R4.2 R6.2 TP13.1), 36Pin_SuperSeal_Conn (J1.A18)
TC+2: U_Amplifier_Filter_System/Th2 (R3.2 R5.2 TP12.1), 36Pin_SuperSeal_Conn (J1.A20)
TC-1: U_Amplifier_Filter_System/Th1 (R2.1 TP3.1), 36Pin_SuperSeal_Conn (J1.A19)
TC-2: U_Amplifier_Filter_System/Th2 (R1.1 TP2.1), 36Pin_SuperSeal_Conn (J1.A21)